# Altium schematic sheet Main.SchDoc
size A
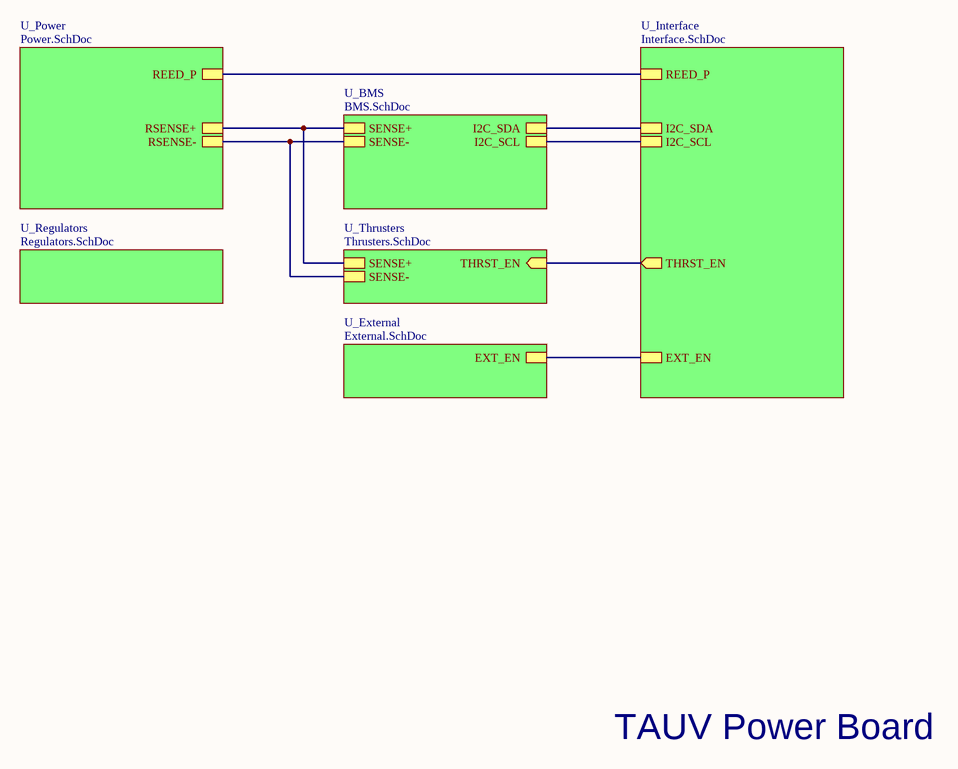
[diagram p0: Main.SchDoc]

## Sub-sheets
U_BMS = BMS.SchDoc: SENSE-, I2C_SDA, I2C_SCL, SENSE+
U_External = External.SchDoc: EXT_EN
U_Interface = Interface.SchDoc: I2C_SDA, I2C_SCL, THRST_EN (out), REED_P, EXT_EN
U_Power = Power.SchDoc: RSENSE-, RSENSE+, REED_P
U_Regulators = Regulators.SchDoc: no entries
U_Thrusters = Thrusters.SchDoc: SENSE-, THRST_EN (in), SENSE+

## Nets
(unnamed): sheet U_BMS/SENSE-, sheet U_Power/RSENSE-, sheet U_Thrusters/SENSE-
(unnamed): sheet U_BMS/I2C_SDA, sheet U_Interface/I2C_SDA
(unnamed): sheet U_BMS/I2C_SCL, sheet U_Interface/I2C_SCL
(unnamed): sheet U_BMS/SENSE+, sheet U_Power/RSENSE+, sheet U_Thrusters/SENSE+
(unnamed): sheet U_Interface/THRST_EN, sheet U_Thrusters/THRST_EN
(unnamed): sheet U_Interface/REED_P, sheet U_Power/REED_P
(unnamed): sheet U_Interface/EXT_EN, sheet U_External/EXT_EN

## Notes on the sheet
- TAUV Power Board